# Altium schematic sheet PL2303(HX).SchDoc
size A4
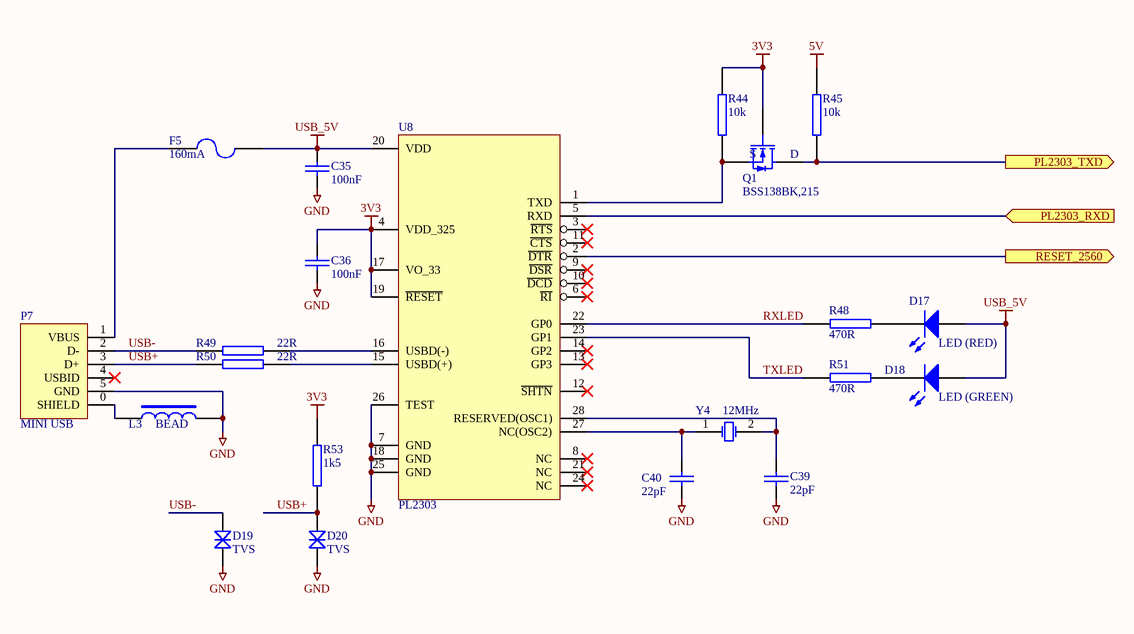
[diagram p0: PL2303(HX).SchDoc]

## Parts
C35  100nF  [CAP (3D) - 0603]
C36  100nF  [CAP (3D) - 0603]
C39  22pF  [CAP (3D) - 0603]
C40  22pF  [CAP (3D) - 0603]
D17  LED (RED)  [LED(3D) 3MM VERTICAL (RED)]
D18  LED (GREEN)  [LED(3D) 3MM VERTICAL (GREEN)]
D19  TVS  [TVS (3D) - 0603]
D20  TVS  [TVS (3D) - 0603]
F5  160mA  [1206]
L3  BEAD  [RES (3D) - 1210]
P7  MINI USB  [MINI USB]
Q1  BSS138BK,215  [SOT23-3L]
R44  10k  [RES (3D) - 0603]
R45  10k  [RES (3D) - 0603]
R48  470R  [RES (3D) - 0603]
R49  22R  [RES (3D) - 0603]
R50  22R  [RES (3D) - 0603]
R51  470R  [RES (3D) - 0603]
R53  1k5  [RES (3D) - 0603]
U8  PL2303  [SSOP28]
Y4  12MHz  [HC49/4H_SMX]

## Ports
PL2303_RXD (in), PL2303_TXD (out), RESET_2560 (out)

## Nets
3V3: C36.1 Q1.1(G) R44.2 R53.1 U8.4(VDD_325) U8.17(VO_33) U8.19(~{RESET})
5V: R45.2
GND: C35.2 C36.2 C39.2 C40.2 D19.1(A) D20.1(A) L3.2 P7.5(GND) U8.7(GND) U8.18(GND) U8.25(GND) U8.26(TEST)
USB_5V: C35.1 D17.1(A) D18.1(A) F5.2 U8.20(VDD)
PL2303_RXD: U8.5(RXD) ; port PL2303_RXD
PL2303_TXD: Q1.3(D) R45.1 ; port PL2303_TXD
RESET_2560: U8.2(~{DTR}) ; port RESET_2560
RXLED: R48.1 U8.22(GP0)
TXLED: R51.1 U8.23(GP1)
USB+: D20.2(K) P7.3(D+) R50.1 R53.2
USB-: D19.2(K) P7.2(D-) R49.1
NetC39_1: C39.1 U8.28(RESERVED(OSC1)) Y4.2(OSC2)
NetC40_1: C40.1 U8.27(NC(OSC2)) Y4.1(OSC1)
NetD17_2: D17.2(K) R48.2
NetD18_2: D18.2(K) R51.2
NetF5_1: F5.1 P7.1(VBUS)
NetL3_1: L3.1 P7.0(SHIELD)
NetQ1_2: Q1.2(S) R44.1 U8.1(TXD)
NetR49_2: R49.2 U8.16(USBD(-))
NetR50_2: R50.2 U8.15(USBD(+))

Not connected (* = marked no-connect by the designer): P7 4(USBID)*; U8 3(~{RTS})* 6(~{RI})* 8(NC)* 9(~{DSR})* 10(~{DCD})* 11(~{CTS})* 12(~{SHTN})* 13(GP3)* 14(GP2)* 21(NC)* 24(NC)*

## Library data of the parts
C35 C36 = CAP SMD 0603 100nF: CAPACITOR SMD 0603; Manufacturer: Murata; Manufacturer Part No.: GCM188R71C104KA37D; Mouser Part no.: 81-GCM188R71C104KA7D; Web link: http://au.mouser.com/ProductDetail/Murata/GCM188R71C104KA37D/?qs=aEuGZpxfbxWKAxwYn%252beTMg%3d%3d; value: 100nF
C39 C40 = CAP SMD 0603 1nF: CAPACITOR SMD 0603; Manufacturer: Vishay; Manufacturer Part No.: VJ0603A220JXACW1BC; value: 22pF; Mouser Part no.: 77-VJ0603A220JXACBC; Web link: http://au.mouser.com/ProductDetail/Vishay-Vitramon/VJ0603A220JXACW1BC/?qs=sGAEpiMZZMv9Q1JI0Mo%2ftTD%2f4380kv7n
D17 = LED 3mm RED: 3mm RED LED; Manufacturer: Lite-On; Manufacturer Part No.: LTL-4261NR; value: RED 3mm; Mouser Part no.: 859-LTL-4261NR; Web link: http://au.mouser.com/ProductDetail/Lite-On/LTL-307E/?qs=sGAEpiMZZMs4quMj8r4lmhnQMFVtnV3yedxNjWAKgTA%3d
D18 = LED 3mm GREEN: 3mm GREEN LED; Manufacturer: Lite-On; Manufacturer Part No.: LTL-1CHG; value: GREEN 3mm; Mouser Part no.: 859-LTL-1CHG; Web link: http://au.mouser.com/ProductDetail/Lite-On/LTL-1CHG/?qs=sGAEpiMZZMs4quMj8r4lmsfF1SjbyuBqGk7sQVhKrYk%3d
D19 D20 = TVS DIODE: Transient Voltage Suppression (TVS) Diode; Manufacturer Part No.: CG0603MLC-05E; Manufacturer: Bourns; Value: TVS; Mouser Part no.: 652-CG0603MLC-05E; Web link: http://au.mouser.com/ProductDetail/Bourns/CG0603MLC-05E/?qs=%2fha2pyFaduj8GWc5RpRwWsoz%252bsBNDfM0b%2fMwO0m8cAS%252b28tb9AwLWQ%3d%3d
F5 = Fuse 2: Fuse; Manufacturer: Littlefuse; Manufacturer Part No.: 1206L016WR; Revision: July-2002: Re-released for DXP Platform.; Mouser Part No.: 576-1206L016WR; Value: 160mA; Web link: http://au.mouser.com/ProductDetail/Littelfuse/1206L016WR/?qs=PWhpLWeW8weybSDHdny44Q%3d%3d
L3 = INDUCTOR SMD 1210 100uH: INDUCTOR SMD 1210; Manufacturer: Fair-Rite; Manufacturer Part No.: 2512063007Y3; Mouser Part no.: 636-2512063007Y3; Web link: http://au.mouser.com/ProductDetail/Fair-Rite/2512063007Y3/?qs=%2fha2pyFadugMqBZ0p6tBCteJ%252bl1Ngi4ZSrBdKx9yVdYrQlmO7YKqKA%3d%3d; Value: BEAD
P7 = MICRO USB: Manufacturer: Keystone Electronics; Manufacturer Part No.: 534-934; value: USB-MICRO; Mouser Part no.: 934; Web link: http://au.mouser.com/ProductDetail/Keystone-Electronics/934/?qs=sGAEpiMZZMulM8LPOQ%252byk%2fSsgKophuqxMvSf7TGGJTc%3d
Q1 = BSS138BK,215 SOT23: N-Channel MOSFET; Manufacturer: NXP Semiconductors; Value: BSS138BK,215; Manufacturer Part No.: BSS138BK,215; Mouser Part no.: 771-BSS138BK215; Web link: http://au.mouser.com/ProductDetail/NXP/BSS138BK215/?qs=%2fha2pyFaduhOCsXH6DamaYx2vFX9CGnGyFNFIdZCCfo2MZSmQFQsKQ%3d%3d
R44 R45 = RES SMD 0603 10k: RESISTOR SMD 0603 10k; Manufacturer: Bourns; Manufacturer Part No.: CR0603FX-1002ELF; Mouser Part no.: 652-CR0603FX-1002ELF; Web link: http://au.mouser.com/Search/Refine.aspx?Keyword=652-CR0603FX-1002ELF; value: 10k
R48 R51 = RES SMD 0603 590R: RESISTOR SMD 0603 590R; Manufacturer: Vishay; Manufacturer Part No.: CRCW0603470RJNEA; Mouser Part no.: 71-CRCW0603J-470-E3; Web link: http://au.mouser.com/ProductDetail/Vishay-Dale/CRCW0603470RJNEA/?qs=sGAEpiMZZMtlubZbdhIBIDQnfxtYKdcjBa1CNCbPnm4%3d; value: 470R
R49 R50 = RES SMD 0603 0R: RESISTOR SMD 0603 0R; Manufacturer: Xicon; Manufacturer Part No.: 301-22-RC; value: 22R; Mouser Part no.: 301-22-RC; Web link: http://au.mouser.com/ProductDetail/Xicon/301-22-RC/?qs=sGAEpiMZZMu61qfTUdNhG77xSY1jRpIyXwGVN4E99m8%3d
R53 = RES SMD 0603 0R: RESISTOR SMD 0603 0R; value: 1k5
U8 = PL2303: PL2303 USB to 232 Converter (FT232 Compatible)
Y4 = XTAL: Crystal Oscillator; Manufacturer: ECS; Value: 12MHz